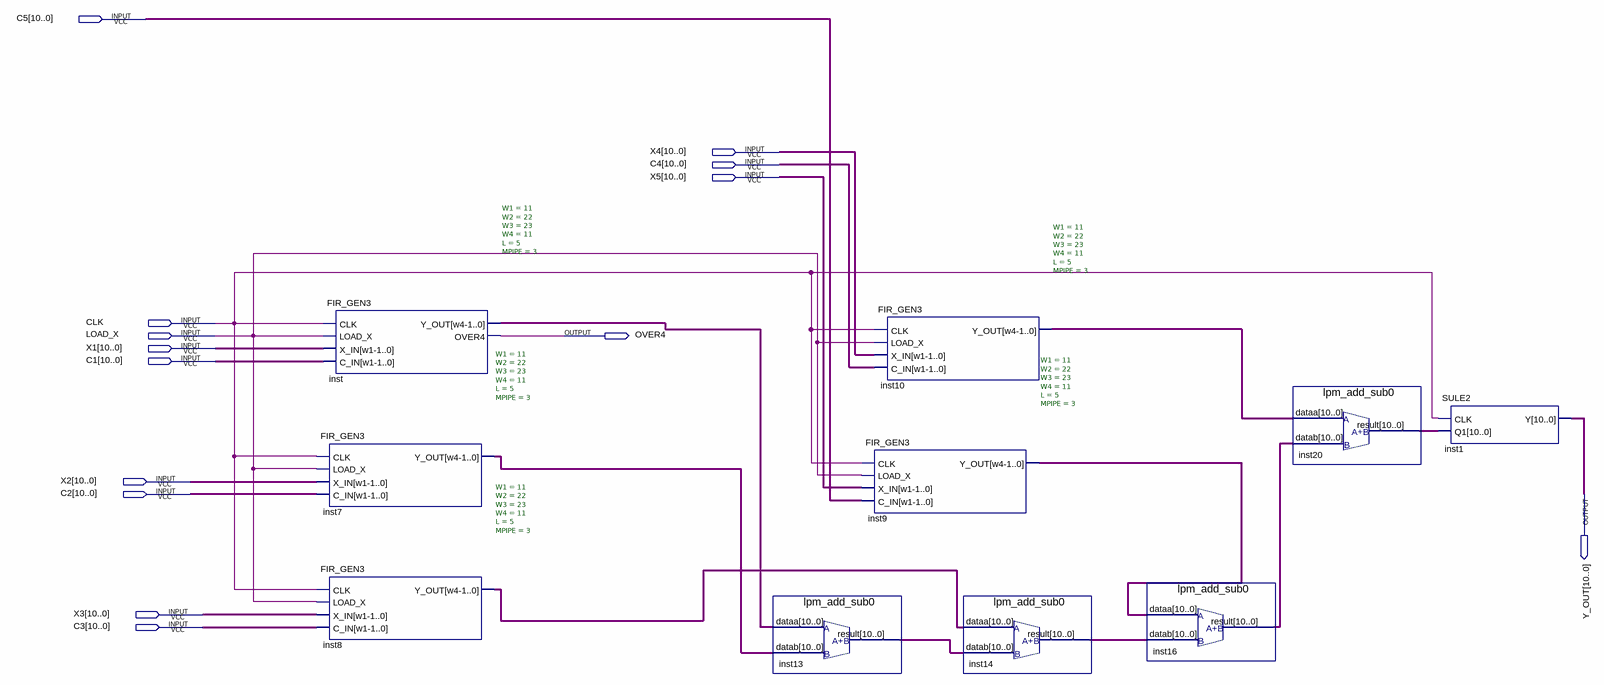
[diagram p0: schematic sheet]
// Quartus schematic CNN4B.bdf as structural Verilog: 10 symbols, 14 pins
module CNN4B (
  input  [10:0] C5,
  input  [10:0] X4,
  input  [10:0] C4,
  input  [10:0] X5,
  input  CLK,
  input  LOAD_X,
  input  [10:0] X1,
  input  [10:0] C1,
  input  [10:0] X2,
  input  [10:0] C2,
  input  [10:0] X3,
  input  [10:0] C3,
  output OVER4,
  output [10:0] Y_OUT
);

  wire [10:0] inst7_y_out, inst8_y_out, inst9_y_out, inst10_y_out, inst13_result, inst14_result,
       inst16_result, inst20_result, inst_y_out;

  FIR_GEN3 #(.W1(11), .W2(22), .W3(23), .W4(11), .L(5), .MPIPE(3)) inst (
    .CLK(CLK), .C_IN(C1), .LOAD_X(LOAD_X), .X_IN(X1), .OVER4(OVER4), .Y_OUT(inst_y_out));
  FIR_GEN3 #(.W1(11), .W2(22), .W3(23), .W4(11), .L(5), .MPIPE(3)) inst7 (
    .CLK(CLK), .C_IN(C2), .LOAD_X(LOAD_X), .X_IN(X2), .Y_OUT(inst7_y_out));
  FIR_GEN3 #(.W1(11), .W2(22), .W3(23), .W4(11), .L(5), .MPIPE(3)) inst8 (
    .CLK(CLK), .C_IN(C3), .LOAD_X(LOAD_X), .X_IN(X3), .Y_OUT(inst8_y_out));
  lpm_add_sub0 inst13 (.dataa(inst_y_out), .datab(inst7_y_out), .result(inst13_result));
  FIR_GEN3 #(.W1(11), .W2(22), .W3(23), .W4(11), .L(5), .MPIPE(3)) inst9 (
    .CLK(CLK), .C_IN(C5), .LOAD_X(LOAD_X), .X_IN(X5), .Y_OUT(inst9_y_out));
  FIR_GEN3 #(.W1(11), .W2(22), .W3(23), .W4(11), .L(5), .MPIPE(3)) inst10 (
    .CLK(CLK), .C_IN(C4), .LOAD_X(LOAD_X), .X_IN(X4), .Y_OUT(inst10_y_out));
  lpm_add_sub0 inst14 (.dataa(inst8_y_out), .datab(inst13_result), .result(inst14_result));
  lpm_add_sub0 inst16 (.dataa(inst9_y_out), .datab(inst14_result), .result(inst16_result));
  lpm_add_sub0 inst20 (.dataa(inst10_y_out), .datab(inst16_result), .result(inst20_result));
  SULE2 inst1 (.CLK(CLK), .Q1(inst20_result), .Y(Y_OUT));
endmodule
